# Altium project lab_08_02.PrjPcb
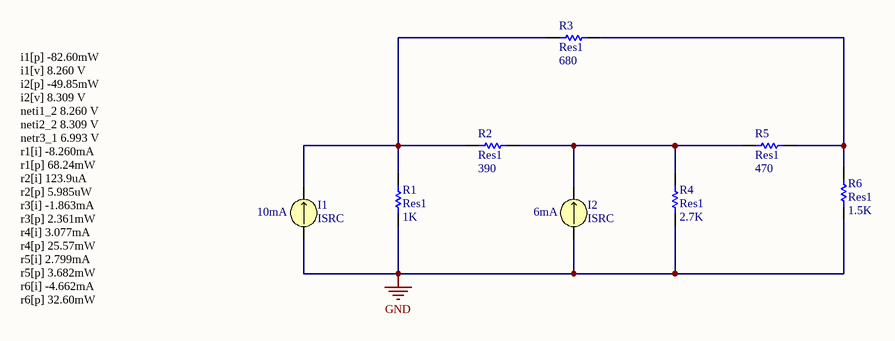
[diagram p0: Sheet2_Lab08.SchDoc]
1 sheet, 8 parts. Net scope: global (net labels, ports and power ports of the same name join across sheets).

## Sheet Sheet2_Lab08.SchDoc: Lab 08 Nodal Analysis Circuit
size 223 x 172 mm; DrawnBy: Abigail Joseph; Revision: A1; SheetNumber: 2; SheetTotal: 2

### Parts
I1  ISRC  value 10mA
I2  ISRC  value 6mA
R1  Res1  value 1K  [AXIAL-0.3]
R2  Res1  value 390  [AXIAL-0.3]
R3  Res1  value 680  [AXIAL-0.3]
R4  Res1  value 2.7K  [AXIAL-0.3]
R5  Res1  value 470  [AXIAL-0.3]
R6  Res1  value 1.5K  [AXIAL-0.3]

### Nets
GND: I1.1 I2.1 R1.1 R4.2 R6.1
NetI1_2: I1.2 R1.2 R2.2 R3.2
NetI2_2: I2.2 R2.1 R4.1 R5.1
NetR3_1: R3.1 R5.2 R6.2

### Notes on the sheet
- i1[p]	-82.60mW
  i1[v]	8.260 V
  i2[p]	-49.85mW
  i2[v]	8.309 V
  neti1_2	8.260 V
  neti2_2	8.309 V
  netr3_1	6.993 V
  r1[i]	-8.260mA
  r1[p]	68.24mW
  r2[i]	123.9uA
  r2[p]	5.985uW
  r3[i]	-1.863mA
  r3[p]	2.361mW
  r4[i]	3.077mA
  r4[p]	25.57mW
  r5[i]	2.799mA
  r5[p]	3.682mW
  r6[i]	-4.662mA
  r6[p]	32.60mW
- Drawn by:
- Date:
- Revision:
- Sheet
- of
- File:
- Size:
- 0.8*Letter
- School of Engineering & Computer Science

### Library data of the parts
I1 I2 = ISRC: Current Source; Note: PCB Footprint - Not required; Published: 8-Jun-2000; LatestRevisionDate: 17-Jul-2002; LatestRevisionNote: Re-released for DXP Platform.; PackageReference: Not Applicable; Publisher: Altium Limited
R1-R6 = Res1: Resistor; Published: 8-Jun-2000; LatestRevisionDate: 17-Jul-2002; LatestRevisionNote: Re-released for DXP Platform.; PackageReference: AXIAL-0.3; Publisher: Altium Limited; PackageDescription: Axial Device, Thru-Hole; 2 Leads; 0.3 in Pin Spacing